# Altium project mimx8mn1dvtjzaa.PrjPcb
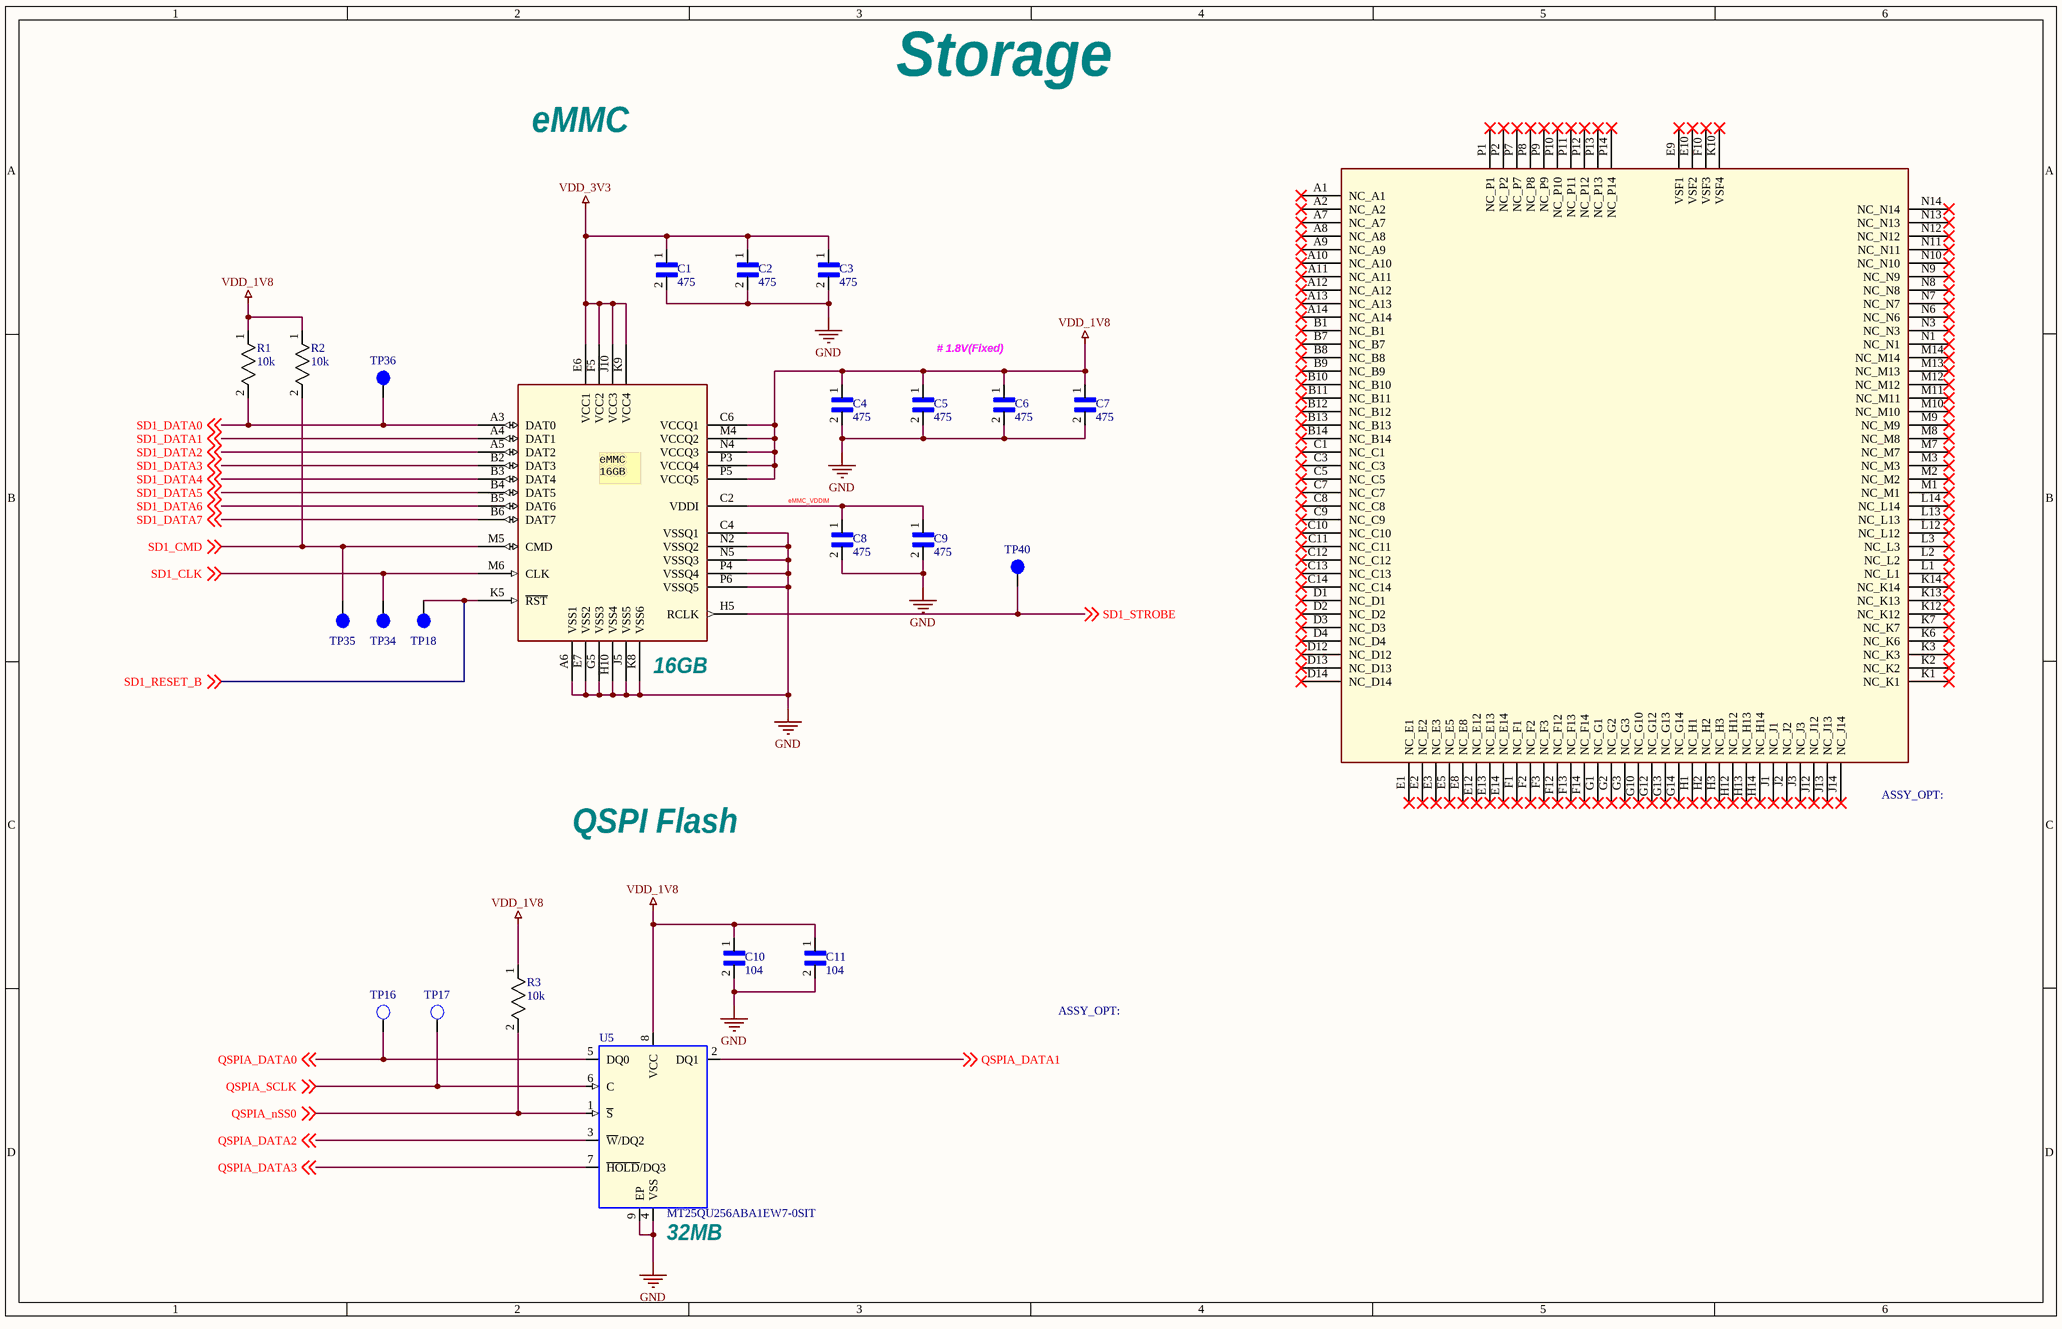
[diagram p0: eMMC_QSPI.SchDoc]
6 sheets, 53 parts. Net scope: global (net labels, ports and power ports of the same name join across sheets).
Board file: mimx8mn1dvtjzaa.PcbDoc
Sheets:
  block.SchDoc
  eMMC_QSPI.SchDoc
  LPDDR4.SchDoc
  mpu_power.SchDoc
  PMIC.SchDoc
  mpu_lpddr4.SchDoc

## Sheet block.SchDoc
size A; SheetNumber: 1; SheetTotal: 1

## Sheet eMMC_QSPI.SchDoc
size 386 x 246 mm; SheetNumber: 2; SheetTotal: 5

### Parts
C1  475  [CAPC1005X55N2]
C2  475  [CAPC1005X55N2]
C3  475  [CAPC1005X55N2]
C4  475  [CAPC1005X55N2]
C5  475  [CAPC1005X55N2]
C6  475  [CAPC1005X55N2]
C7  475  [CAPC1005X55N2]
C8  475  [CAPC1005X55N2]
C9  475  [CAPC1005X55N2]
C10  104  [CAPC1005X55N2]
C11  104  [CAPC1005X55N2]
R1  10k  [RC0402X]
R2  10k  [RC0402X]
R3  10k  [RC0402X]
TP16  TP_35MIL  [testpoint_35mil]  (value not drawn)
TP17  TP_35MIL  [testpoint_35mil]  (value not drawn)
TP18  tpad_020  [tpad_020]  (value not drawn)
TP34  tpad_020  [tpad_020]  (value not drawn)
TP35  TPAD_015  [TPAD_015]  (value not drawn)
TP36  tpad_020  [tpad_020]  (value not drawn)
TP40  TPAD_015  [TPAD_015]  (value not drawn)
U1  SDINBDG4-16G_VFBGA_153P  [BGA153N50P14X14_1300X1150X80]  (value not drawn)  (parts A,B of 2)
U5  MT25QU256ABA1EW7-0SIT  [dfn8_1p27_6x5mm_3p1]

### Nets
GND: C1.2 C2.2 C3.2 C4.2 C5.2 C6.2 C7.2 C8.2 C9.2 C10.2 C11.2 U1.A6(VSS1) U1.C4(VSSQ1) U1.E7(VSS2) U1.G5(VSS3) U1.H10(VSS4) U1.J5(VSS5) U1.K8(VSS6) U1.N2(VSSQ2) U1.N5(VSSQ3) U1.P4(VSSQ4) U1.P6(VSSQ5) U5.4(VSS) U5.9(EP)
VDD_1V8: C4.1 C5.1 C6.1 C7.1 C10.1 C11.1 R1.1 R2.1 R3.1 U1.C6(VCCQ1) U1.M4(VCCQ2) U1.N4(VCCQ3) U1.P3(VCCQ4) U1.P5(VCCQ5) U5.8(VCC)
VDD_3V3: C1.1 C2.1 C3.1 U1.E6(VCC1) U1.F5(VCC2) U1.J10(VCC3) U1.K9(VCC4)
eMMC_VDDIM: C8.1 C9.1 U1.C2(VDDI)
QSPIA_DATA0: TP16.1(TP) U5.5(DQ0) ; off-sheet QSPIA_DATA0
QSPIA_DATA1: U5.2(DQ1) ; off-sheet QSPIA_DATA1
QSPIA_DATA2: U5.3(~{W}/DQ2) ; off-sheet QSPIA_DATA2
QSPIA_DATA3: U5.7(~{HOLD}/DQ3) ; off-sheet QSPIA_DATA3
QSPIA_nSS0: R3.2 U5.1(~{S}) ; off-sheet QSPIA_nSS0
QSPIA_SCLK: TP17.1(TP) U5.6(C) ; off-sheet QSPIA_SCLK
SD1_CLK: TP34.1(Pin1) U1.M6(CLK) ; off-sheet SD1_CLK
SD1_CMD: R2.2 TP35.1(Pin1) U1.M5(CMD) ; off-sheet SD1_CMD
SD1_DATA0: R1.2 TP36.1(Pin1) U1.A3(DAT0) ; off-sheet SD1_DATA0
SD1_DATA1: U1.A4(DAT1) ; off-sheet SD1_DATA1
SD1_DATA2: U1.A5(DAT2) ; off-sheet SD1_DATA2
SD1_DATA3: U1.B2(DAT3) ; off-sheet SD1_DATA3
SD1_DATA4: U1.B3(DAT4) ; off-sheet SD1_DATA4
SD1_DATA5: U1.B4(DAT5) ; off-sheet SD1_DATA5
SD1_DATA6: U1.B5(DAT6) ; off-sheet SD1_DATA6
SD1_DATA7: U1.B6(DAT7) ; off-sheet SD1_DATA7
SD1_RESET_B: TP18.1(Pin1) U1.K5(~{RST}) ; off-sheet SD1_RESET_B
SD1_STROBE: TP40.1(Pin1) U1.H5(RCLK) ; off-sheet SD1_STROBE

Not connected (* = marked no-connect by the designer): U1 A1(NC_A1)* A2(NC_A2)* A7(NC_A7)* A8(NC_A8)* A9(NC_A9)* A10(NC_A10)* A11(NC_A11)* A12(NC_A12)* A13(NC_A13)* A14(NC_A14)* B1(NC_B1)* B7(NC_B7)* B8(NC_B8)* B9(NC_B9)* B10(NC_B10)* B11(NC_B11)* B12(NC_B12)* B13(NC_B13)* B14(NC_B14)* C1(NC_C1)* C3(NC_C3)* C5(NC_C5)* C7(NC_C7)* C8(NC_C8)* C9(NC_C9)* C10(NC_C10)* C11(NC_C11)* C12(NC_C12)* C13(NC_C13)* C14(NC_C14)* D1(NC_D1)* D2(NC_D2)* D3(NC_D3)* D4(NC_D4)* D12(NC_D12)* D13(NC_D13)* D14(NC_D14)* E1(NC_E1)* E2(NC_E2)* E3(NC_E3)* E5(NC_E5)* E8(NC_E8)* E9(VSF1)* E10(VSF2)* E12(NC_E12)* E13(NC_E13)* E14(NC_E14)* F1(NC_F1)* F2(NC_F2)* F3(NC_F3)* F10(VSF3)* F12(NC_F12)* F13(NC_F13)* F14(NC_F14)* G1(NC_G1)* G2(NC_G2)* G3(NC_G3)* G10(NC_G10)* G12(NC_G12)* G13(NC_G13)* G14(NC_G14)* H1(NC_H1)* H2(NC_H2)* H3(NC_H3)* H12(NC_H12)* H13(NC_H13)* H14(NC_H14)* J1(NC_J1)* J2(NC_J2)* J3(NC_J3)* J12(NC_J12)* J13(NC_J13)* J14(NC_J14)* K1(NC_K1)* K2(NC_K2)* K3(NC_K3)* K6(NC_K6)* K7(NC_K7)* K10(VSF4)* K12(NC_K12)* K13(NC_K13)* K14(NC_K14)* L1(NC_L1)* L2(NC_L2)* L3(NC_L3)* L12(NC_L12)* L13(NC_L13)* L14(NC_L14)* M1(NC_M1)* M2(NC_M2)* M3(NC_M3)* M7(NC_M7)* M8(NC_M8)* M9(NC_M9)* M10(NC_M10)* M11(NC_M11)* M12(NC_M12)* M13(NC_M13)* M14(NC_M14)* N1(NC_N1)* N3(NC_N3)* N6(NC_N6)* N7(NC_N7)* N8(NC_N8)* N9(NC_N9)* N10(NC_N10)* N11(NC_N11)* N12(NC_N12)* N13(NC_N13)* N14(NC_N14)* P1(NC_P1)* P2(NC_P2)* P7(NC_P7)* P8(NC_P8)* P9(NC_P9)* P10(NC_P10)* P11(NC_P11)* P12(NC_P12)* P13(NC_P13)* P14(NC_P14)*

### Notes on the sheet
- Storage
- eMMC
- # 1.8V(Fixed)
- (near U1) 16GB
- QSPI Flash
- (near U5) 32MB
- (in symbol SDINBDG4-16G_VFBGA_153P, part A) eMMC / 16GB

### Library data of the parts
C1-C9 = CC0402MRX5R6BB475: Multilayer Ceramic Capacitor, 4.7 uF, 50 V, ï¿½ 10%, X5R, 0402 [1005 Metric]; Manufacturer: Yageo; Capacitance: 4.7uF; Voltage Rating: 10V; Tolerance: 20%; Temperature Coefficient: 30ppm/°C; Supplier 1: Digikey; Manufacturer Part Number: CC0402MRX5R6BB475; RoHS: Yes; Category: Ceramic Capacitors; Stock 1: 1209136; Pricing 1: 1=0.1, 10=0.053, 50=0.0364, 100=0.0313, 500=0.0227, 1000=0.02003, 2500=0.01719, 5000=0.01547 (USD); Mount: Surface Mount; Case/Package: 0402; Case Code (Metric): 1005; Case Code (Imperial): 0402; Weight: 2.3E-05oz; Material: Ceramic; Min Operating Temperature: -55°C; Max Operating Temperature: 85°C; Packaging: Tape and Reel; Dielectric: X5R; Termination: SMD/SMT; Voltage Rating (DC): 10V; Package Quantity: 10000; Series: CC; Length: 0.039inch; Width: 0.02inch; Height: 0.5mm; Thickness: 0.022inch; Lead Free: Lead Free; Halogen Free: Halogen Free; RoHS Compliant: Yes; ComponentLink1URL: http://www.mouser.com/ds/2/447/Yageo_UPY-GP_NP0_16V-to-50V_9-358835.pdf?src-supplier=Mouser; ComponentLink1Description: http://www.mouser.com/ds/2/447/Yageo_UPY-GP_NP0_16V-to-50V_9-358835.pdf?src-supplier=Mouser; ComponentLink2URL: http://www.yageo.com/documents/recent/UPY-GPHC_X5R_4V-to-50V_25.pdf?src-supplier=Digikey; ComponentLink2Description: http://www.yageo.com/documents/recent/UPY-GPHC_X5R_4V-to-50V_25.pdf?src-supplier=Digikey; ComponentLink3URL: http://www.yageo.com/exep/pages/download/literatures/ProductSelectionGuide%202014_Final_2.pdf?src-supplier=Digikey; ComponentLink3Description: http://www.yageo.com/exep/pages/download/literatures/ProductSelectionGuide%202014_Final_2.pdf?src-supplier=Digikey; ComponentLink4URL: https://datasheet.octopart.com/CC0402MRX5R6BB475-Yageo-datasheet-140260304.pdf?src-supplier=Newark; ComponentLink4Description: https://datasheet.octopart.com/CC0402MRX5R6BB475-Yageo-datasheet-140260304.pdf?src-supplier=Newark; LCSC: C469468; Supplier Part Number 1: 311-1734-1-ND
C10 C11 = CC0402KRX7R7BB104: Multilayer Ceramic Capacitor, 0.1 uF, 16 V, ï¿½ 10%, X7R, 0402 [1005 Metric]; Manufacturer: Yageo; Material: 4241ConductorMaterial; Capacitance: 100nF; Voltage Rating: 16V; Temperature Coefficient: 30ppm/°C; Supplier 1: Digikey; Manufacturer Part Number: CC0402KRX7R7BB104; RoHS: Yes; Category: Ceramic Capacitors; Stock 1: 15609894; Pricing 1: 1=0.1, 10=0.024, 50=0.0164, 100=0.0139, 500=0.0098, 1000=0.00852, 2500=0.00718, 5000=0.00636 (USD); Mount: Surface Mount; Case/Package: 0402; Number of Pins: 2; Case Code (Metric): 1005; Case Code (Imperial): 0402; Min Operating Temperature: -55°C; Max Operating Temperature: 125°C; Tolerance: 10%; Voltage Rating (DC): 16V; Packaging: Tape and Reel; Package Quantity: 1; Dielectric: X7R; Termination: SMD/SMT; Voltage: 16V; Series: CC; Voltage Rating (AC): 16V; Length: 1mm; Width: 0.02inch; Height: 0.5mm; Thickness: 0.022inch; Depth: 0.5mm; Radiation Hardening: No; Reach SVHC Compliant: No; RoHS Compliant: Yes; Halogen Free: 5694HalogenFree; Lead Free: 5697LeadFree; ComponentLink1URL: https://datasheet.ciiva.com/11788/0900766b80ce67ed-11788364.pdf?src-supplier=Rs; ComponentLink1Description: https://datasheet.ciiva.com/11788/0900766b80ce67ed-11788364.pdf?src-supplier=Rs; ComponentLink2URL: https://datasheet.ciiva.com/7978/1489800-7978111.pdf?src-supplier=Element14; ComponentLink2Description: https://datasheet.ciiva.com/7978/1489800-7978111.pdf?src-supplier=Element14; ComponentLink3URL: https://datasheet.ciiva.com/161/mlccorderingcode-161545.pdf?src-supplier=Digikey; ComponentLink3Description: https://datasheet.ciiva.com/161/mlccorderingcode-161545.pdf?src-supplier=Digikey; ComponentLink4URL: https://datasheet.ciiva.com/161/mlccorderingcode-161544.pdf?src-supplier=Digikey; ComponentLink4Description: https://datasheet.ciiva.com/161/mlccorderingcode-161544.pdf?src-supplier=Digikey; ComponentLink5URL: https://datasheet.ciiva.com/161/mlccorderingcode-161546.pdf?src-supplier=Digikey; ComponentLink5Description: https://datasheet.ciiva.com/161/mlccorderingcode-161546.pdf?src-supplier=Digikey; ComponentLink6URL: https://datasheet.ciiva.com/8033/1734573-8033661.pdf?src-supplier=Element14; ComponentLink6Description: https://datasheet.ciiva.com/8033/1734573-8033661.pdf?src-supplier=Element14; ComponentLink7URL: https://datasheet.ciiva.com/11587/upy-gphc-x7r-6-3v-to-50v-8-11587305.pdf?src-supplier=Avnet; ComponentLink7Description: https://datasheet.ciiva.com/11587/upy-gphc-x7r-6-3v-to-50v-8-11587305.pdf?src-supplier=Avnet; LCSC: C60474; Supplier Part Number 1: 311-1338-1-ND
R1-R3 = RC0402JR-0710KL: SMD Chip Resistor, 10 kOhm, ï¿½ 5%, 62.5 mW, 0402 [1005 Metric], Thick Film, General Purpose; Manufacturer: Yageo; Resistance: 10kR; Power Rating: 62.5mW; Voltage Rating: 50V; Temperature Coefficient: 100ppm/°C; Max Power Dissipation: 63mW; Supplier 1: Digikey; Manufacturer Part Number: RC0402JR-0710KL; RoHS: Yes; Category: Chip SMD Resistors; Stock 1: 16677034; Pricing 1: 1=0.1, 10=0.007, 50=0.0066, 100=0.0061, 500=0.0051, 1000=0.00408, 5000=0.00284 (USD); Case/Package: 0402; Case Code (Metric): 1005; Case Code (Imperial): 0402; Size Code: 0402; Min Operating Temperature: -55°C; Max Operating Temperature: 155°C; Packaging: Tape and Reel; Tolerance: 5%; Package Quantity: 1; Resistor Type: Thick Film; Number of Terminations: 2; Termination: SMD/SMT; Features: Moisture Resistant; Series: RC; Resistance Tolerance: 5%; Construction: Rectangular; Voltage Rating (AC): 50V; Length: 0.039inch; Width: 0.02inch; Height: 0.016inch; Depth: 0.5mm; Military Standard: Not; Lead Free: Lead Free; RoHS Compliant: Yes; Reach SVHC Compliant: Unknown; ComponentLink1URL: https://datasheet.ciiva.com/2452/pyu-r-int-thick-7-2452626.pdf?src-supplier=Digikey; ComponentLink1Description: https://datasheet.ciiva.com/2452/pyu-r-int-thick-7-2452626.pdf?src-supplier=Digikey; ComponentLink2URL: https://datasheet.ciiva.com/2452/pyu-r-int-thick-7-2452627.pdf?src-supplier=Digikey; ComponentLink2Description: https://datasheet.ciiva.com/2452/pyu-r-int-thick-7-2452627.pdf?src-supplier=Digikey; ComponentLink3URL: https://datasheet.ciiva.com/2452/pyu-r-int-thick-7-2452628.pdf?src-supplier=Digikey; ComponentLink3Description: https://datasheet.ciiva.com/2452/pyu-r-int-thick-7-2452628.pdf?src-supplier=Digikey; ComponentLink4URL: https://datasheet.ciiva.com/7850/1018594-7850136.pdf?src-supplier=Element14; ComponentLink4Description: https://datasheet.ciiva.com/7850/1018594-7850136.pdf?src-supplier=Element14; ComponentLink5URL: https://datasheet.ciiva.com/7850/1018594-7850137.pdf?src-supplier=Element14; ComponentLink5Description: https://datasheet.ciiva.com/7850/1018594-7850137.pdf?src-supplier=Element14; ComponentLink6URL: https://datasheet.ciiva.com/12669/pyu-rc0402-51-rohs-l-6-r-12669687.pdf?src-supplier=Mouser; ComponentLink6Description: https://datasheet.ciiva.com/12669/pyu-rc0402-51-rohs-l-6-r-12669687.pdf?src-supplier=Mouser; Supplier Part Number 1: 311-10KJRCT-ND
TP16 TP17 = T POINT R: TEST POINT PAD .035 SMT, no part to order; ASSY_OPT: DNP; CLASS: IC; CAD_APPROVED: Yes; AGILE_PN: 510-75618; HEIGHT: 0.1MM; ROHS: Yes; PCB Footprint: testpoint_35mil
TP18 TP36 = TESTLOOP: TEST POINT PAD 0.5MM DIA SMT, NO PART TO ORDER; CLASS: IO; ASSY_OPT: DNP; AGILE_PN: 211-77484; CAD_APPROVED: Yes; ROHS: Yes; HEIGHT: 0.1MM; PCB Footprint: tpad_020
TP34 = TESTLOOP: TEST POINT PAD 0.5MM DIA SMT, NO PART TO ORDER; CLASS: IO; ASSY_OPT: DNP; CAD_APPROVED: Yes; AGILE_PN: 211-77484; HEIGHT: 0.1MM; ROHS: Yes; PCB Footprint: tpad_020
TP35 = TESTLOOP: TEST POINT PAD 15MIL DIA SMT, NO PART TO ORDER; CLASS: IO; ASSY_OPT: DNP; AGILE_PN: 211-76645; MFG_NAME01: NOTACOMPONENT; CAD_APPROVED: Yes; MFG_PN01: NOTACOMPONENT; ROHS: Yes; HEIGHT: 0.1MM; PCB Footprint: TPAD_015
TP40 = TESTLOOP: TEST POINT PAD 15MIL DIA SMT, NO PART TO ORDER; CLASS: IO; AGILE_PN: 211-76645; MFG_NAME01: NOTACOMPONENT; CAD_APPROVED: Yes; MFG_PN01: NOTACOMPONENT; ROHS: Yes; HEIGHT: 0.1MM; PCB Footprint: TPAD_015
U1 = SDINBDG4-16G_VFBGA_153P: CLASS: IC
U5 = MT25QL256ABA1EW9_9P: IC MEM FLASH SERIAL NOR 256MBIT 166MHZ 1.7-2V WPDFN8; AGILE_PN: 334-77688; MFG_NAME01: MICRON; CAD_APPROVED: Yes; CLASS: IC; PCB Footprint: dfn8_1p27_6x5mm_3p1; MFG_PN01: MT25QU256ABA1EW7-0SIT; ROHS: Yes; HEIGHT: 0.8 MM; VOLTAGE: 1.7-2V

## Sheet LPDDR4.SchDoc
size A3; SheetNumber: 3; SheetTotal: 3
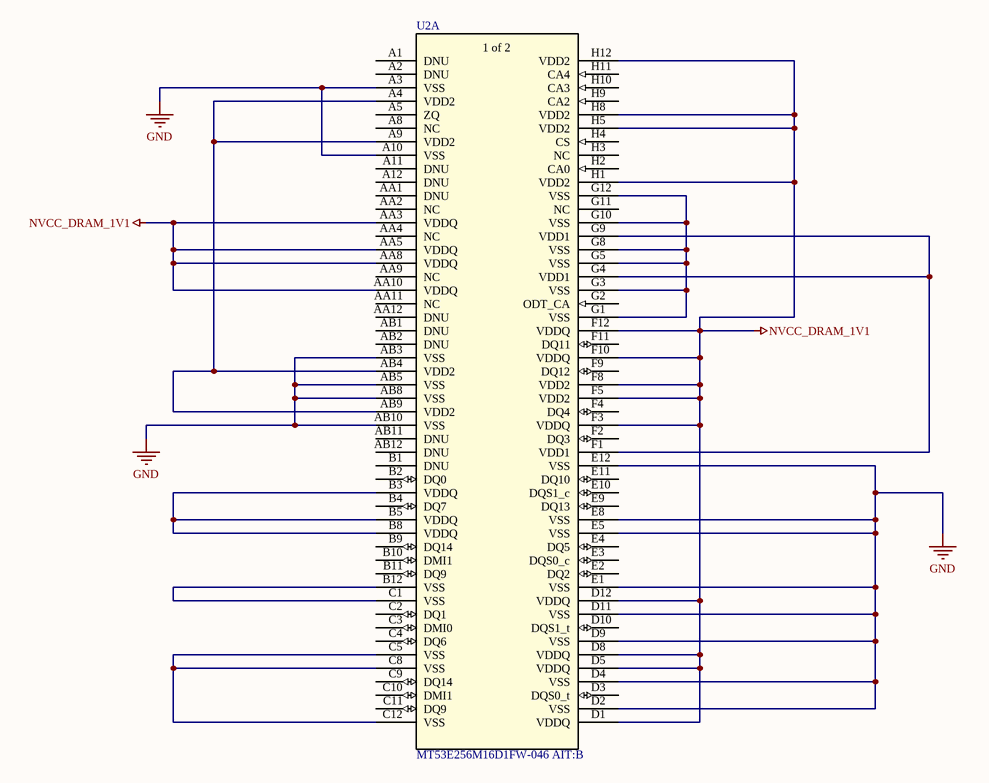
[diagram p1: LPDDR4.SchDoc]

### Parts
U2  MT53E256M16D1FW-046 AIT:B  [TFBGA200_10X14p5X1p1_FW_MRN-M]  (part A of 2)

### Nets
GND: U2.A3(VSS) U2.A10(VSS) U2.AB3(VSS) U2.AB5(VSS) U2.AB8(VSS) U2.AB10(VSS) U2.D2(VSS) U2.D4(VSS) U2.D9(VSS) U2.D11(VSS) U2.E1(VSS) U2.E5(VSS) U2.E8(VSS) U2.E12(VSS)
NVCC_DRAM_1V1: U2.AA3(VDDQ) U2.AA5(VDDQ) U2.AA8(VDDQ) U2.AA10(VDDQ) U2.D1(VDDQ) U2.D5(VDDQ) U2.D8(VDDQ) U2.D12(VDDQ) U2.F3(VDDQ) U2.F5(VDD2) U2.F8(VDD2) U2.F10(VDDQ) U2.F12(VDDQ) U2.H1(VDD2) U2.H5(VDD2) U2.H8(VDD2) U2.H12(VDD2)
NetU2_A4: U2.A4(VDD2) U2.A9(VDD2) U2.AB4(VDD2) U2.AB9(VDD2)
NetU2_B3: U2.B3(VDDQ) U2.B5(VDDQ) U2.B8(VDDQ)
NetU2_B12: U2.B12(VSS) U2.C1(VSS)
NetU2_C5: U2.C5(VSS) U2.C8(VSS) U2.C12(VSS)
NetU2_F1: U2.F1(VDD1) U2.G4(VDD1) U2.G9(VDD1)
NetU2_G1: U2.G1(VSS) U2.G3(VSS) U2.G5(VSS) U2.G8(VSS) U2.G10(VSS) U2.G12(VSS)

Not connected (* = marked no-connect by the designer): U2 A1(DNU) A2(DNU) A5(ZQ) A8(NC) A11(DNU) A12(DNU) AA1(DNU) AA2(NC) AA4(NC) AA9(NC) AA11(NC) AA12(DNU) AB1(DNU) AB2(DNU) AB11(DNU) AB12(DNU) B1(DNU) B2(DQ0) B4(DQ7) B9(DQ14) B10(DMI1) B11(DQ9) C2(DQ1) C3(DMI0) C4(DQ6) C9(DQ14) C10(DMI1) C11(DQ9) D3(DQS0_t) D10(DQS1_t) E2(DQ2) E3(DQS0_c) E4(DQ5) E9(DQ13) E10(DQS1_c) E11(DQ10) F2(DQ3) F4(DQ4) F9(DQ12) F11(DQ11) G2(ODT_CA) G11(NC) H2(CA0) H3(NC) H4(CS) H9(CA2) H10(CA3) H11(CA4)

### Notes on the sheet
- (in symbol MT53E256M16D1FW-046 AIT:B, part A) 1 of 2

### Library data of the parts
U2 = MT53E256M16D1FW-046 AIT:B: No Description Available; Mfr_Name: Micron; Type: Memory; RefDes: RefDes

## Sheet mpu_power.SchDoc
size A3; SheetNumber: 4; SheetTotal: 5
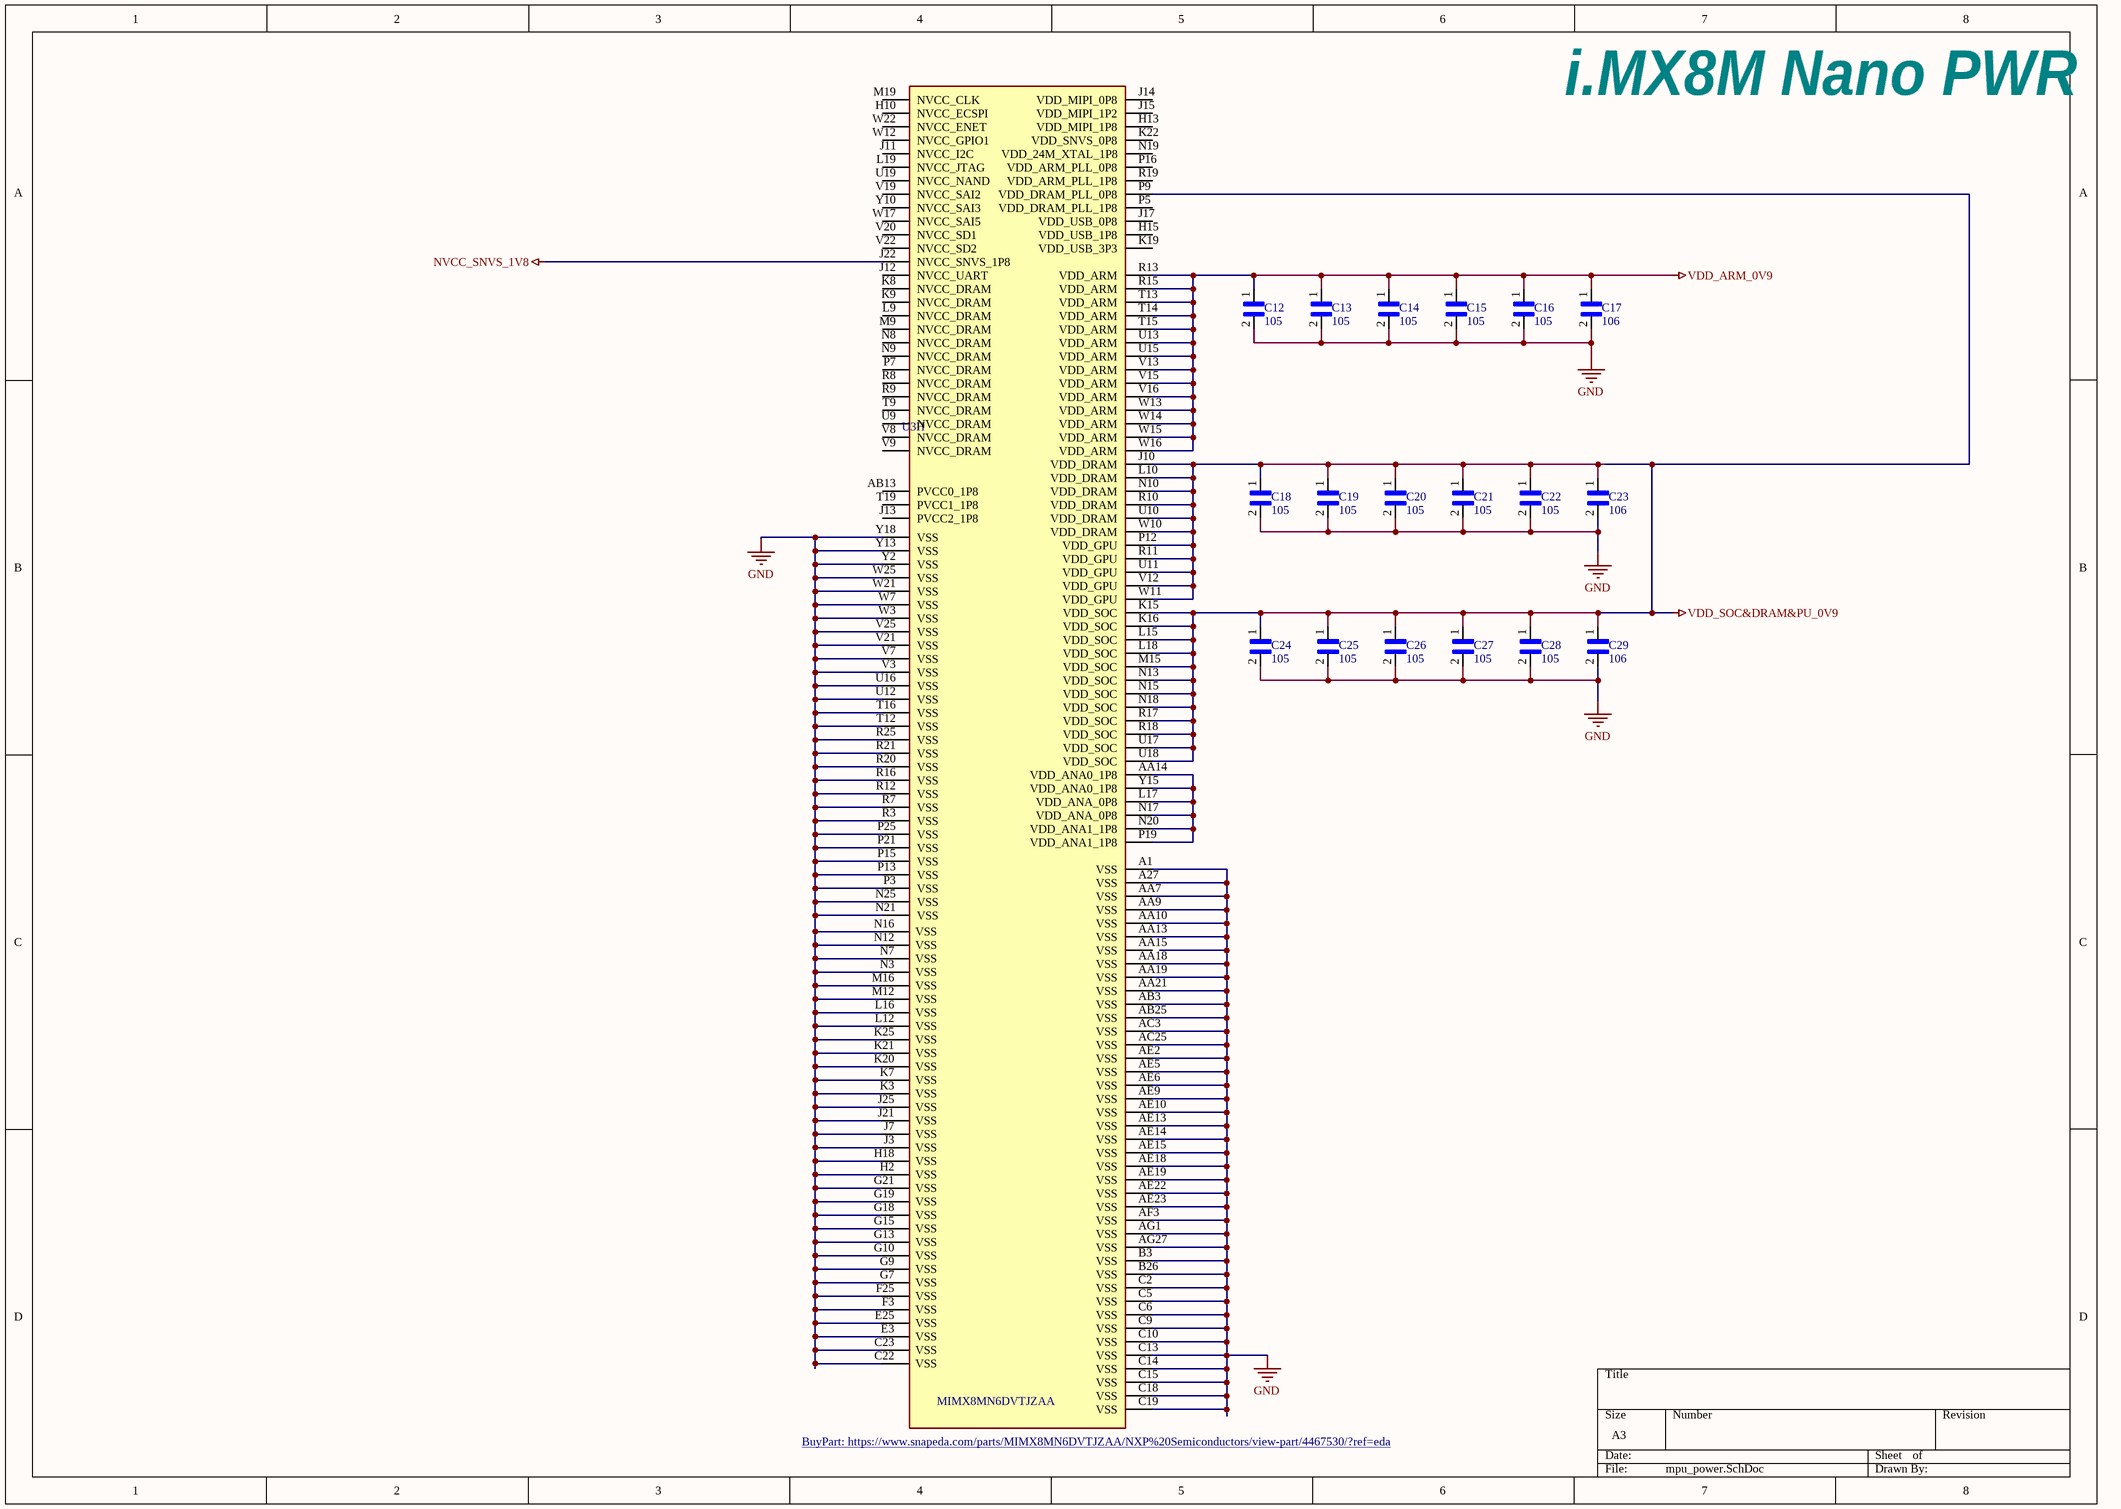
[diagram p2: mpu_power.SchDoc]

### Parts
C12  105  [RC0402]
C13  105  [RC0402]
C14  105  [RC0402]
C15  105  [RC0402]
C16  105  [RC0402]
C17  106  [CL05A106MQ5NUNC]
C18  105  [RC0402]
C19  105  [RC0402]
C20  105  [RC0402]
C21  105  [RC0402]
C22  105  [RC0402]
C23  106  [CL05A106MQ5NUNC]
C24  105  [RC0402]
C25  105  [RC0402]
C26  105  [RC0402]
C27  105  [RC0402]
C28  105  [RC0402]
C29  106  [CL05A106MQ5NUNC]
U3  MIMX8MN6DVTJZAA  [BGA486N50P27X27_1400X1400X125N]  (part H of 8)

### Nets
GND: C12.2 C13.2 C14.2 C15.2 C16.2 C17.2 C18.2 C19.2 C20.2 C21.2 C22.2 C23.2 C24.2 C25.2 C26.2 C27.2 C28.2 C29.2 U3.A1(VSS) U3.A27(VSS) U3.AA7(VSS) U3.AA9(VSS) U3.AA10(VSS) U3.AA13(VSS) U3.AA18(VSS) U3.AA19(VSS) U3.AA21(VSS) U3.AB3(VSS) U3.AB25(VSS) U3.AC3(VSS) U3.AC25(VSS) U3.AE2(VSS) U3.AE5(VSS) U3.AE6(VSS) U3.AE9(VSS) U3.AE10(VSS) U3.AE13(VSS) U3.AE14(VSS) U3.AE15(VSS) U3.AE18(VSS) U3.AE19(VSS) U3.AE22(VSS) U3.AE23(VSS) U3.AF3(VSS) U3.AG1(VSS) U3.AG27(VSS) U3.B3(VSS) U3.B26(VSS) U3.C2(VSS) U3.C5(VSS) U3.C6(VSS) U3.C9(VSS) U3.C10(VSS) U3.C13(VSS) U3.C14(VSS) U3.C15(VSS) U3.C18(VSS) U3.C19(VSS) U3.C22(VSS) U3.C23(VSS) U3.E3(VSS) U3.E25(VSS) U3.F3(VSS) U3.F25(VSS) U3.G7(VSS) U3.G9(VSS) U3.G10(VSS) U3.G13(VSS) U3.G15(VSS) U3.G18(VSS) U3.G19(VSS) U3.G21(VSS) U3.H2(VSS) U3.H18(VSS) U3.J3(VSS) U3.J7(VSS) U3.J21(VSS) U3.J25(VSS) U3.K3(VSS) U3.K7(VSS) U3.K20(VSS) U3.K21(VSS) U3.K25(VSS) U3.L12(VSS) U3.L16(VSS) U3.M12(VSS) U3.M16(VSS) U3.N3(VSS) U3.N7(VSS) U3.N12(VSS) U3.N16(VSS) U3.N21(VSS) U3.N25(VSS) U3.P3(VSS) U3.P13(VSS) U3.P15(VSS) U3.P21(VSS) U3.P25(VSS) U3.R3(VSS) U3.R7(VSS) U3.R12(VSS) U3.R16(VSS) U3.R20(VSS) U3.R21(VSS) U3.R25(VSS) U3.T12(VSS) U3.T16(VSS) U3.U12(VSS) U3.U16(VSS) U3.V3(VSS) U3.V7(VSS) U3.V21(VSS) U3.V25(VSS) U3.W3(VSS) U3.W7(VSS) U3.W21(VSS) U3.W25(VSS) U3.Y2(VSS) U3.Y13(VSS) U3.Y18(VSS)
NVCC_SNVS_1V8: U3.J22(NVCC_SNVS_1P8)
VDD_ARM_0V9: C12.1 C13.1 C14.1 C15.1 C16.1 C17.1 U3.R13(VDD_ARM) U3.R15(VDD_ARM) U3.T13(VDD_ARM) U3.T14(VDD_ARM) U3.T15(VDD_ARM) U3.U13(VDD_ARM) U3.U15(VDD_ARM) U3.V13(VDD_ARM) U3.V15(VDD_ARM) U3.V16(VDD_ARM) U3.W13(VDD_ARM) U3.W14(VDD_ARM) U3.W15(VDD_ARM) U3.W16(VDD_ARM)
VDD_SOC&DRAM&PU_0V9: C18.1 C19.1 C20.1 C21.1 C22.1 C23.1 C24.1 C25.1 C26.1 C27.1 C28.1 C29.1 U3.J10(VDD_DRAM) U3.K15(VDD_SOC) U3.K16(VDD_SOC) U3.L10(VDD_DRAM) U3.L15(VDD_SOC) U3.L18(VDD_SOC) U3.M15(VDD_SOC) U3.N10(VDD_DRAM) U3.N13(VDD_SOC) U3.N15(VDD_SOC) U3.N18(VDD_SOC) U3.P9(VDD_DRAM_PLL_0P8) U3.P12(VDD_GPU) U3.R10(VDD_DRAM) U3.R11(VDD_GPU) U3.R17(VDD_SOC) U3.R18(VDD_SOC) U3.U10(VDD_DRAM) U3.U11(VDD_GPU) U3.U17(VDD_SOC) U3.U18(VDD_SOC) U3.V12(VDD_GPU) U3.W10(VDD_DRAM) U3.W11(VDD_GPU)
NetU3_AA14: U3.AA14(VDD_ANA0_1P8) U3.L17(VDD_ANA_0P8) U3.N17(VDD_ANA_0P8) U3.N20(VDD_ANA1_1P8) U3.P19(VDD_ANA1_1P8) U3.Y15(VDD_ANA0_1P8)

Not connected (* = marked no-connect by the designer): U3 AA15(VSS) AB13(PVCC0_1P8) H10(NVCC_ECSPI) H13(VDD_MIPI_1P8) H15(VDD_USB_1P8) J11(NVCC_I2C) J12(NVCC_UART) J13(PVCC2_1P8) J14(VDD_MIPI_0P8) J15(VDD_MIPI_1P2) J17(VDD_USB_0P8) K8(NVCC_DRAM) K9(NVCC_DRAM) K19(VDD_USB_3P3) K22(VDD_SNVS_0P8) L9(NVCC_DRAM) L19(NVCC_JTAG) M9(NVCC_DRAM) M19(NVCC_CLK) N8(NVCC_DRAM) N9(NVCC_DRAM) N19(VDD_24M_XTAL_1P8) P5(VDD_DRAM_PLL_1P8) P7(NVCC_DRAM) P16(VDD_ARM_PLL_0P8) R8(NVCC_DRAM) R9(NVCC_DRAM) R19(VDD_ARM_PLL_1P8) T9(NVCC_DRAM) T19(PVCC1_1P8) U9(NVCC_DRAM) U19(NVCC_NAND) V8(NVCC_DRAM) V9(NVCC_DRAM) V19(NVCC_SAI2) V20(NVCC_SD1) V22(NVCC_SD2) W12(NVCC_GPIO1) W17(NVCC_SAI5) W22(NVCC_ENET) Y10(NVCC_SAI3)

### Notes on the sheet
- i.MX8M Nano PWR

### Library data of the parts
C12-C16 C18-C22 C24-C28 = CC0402KRX5R5BB105: Multilayer Ceramic Capacitor, 1 uF, 100 V, ï¿½ 10%, X7R, 0402 [1005 Metric]; Manufacturer: Yageo; Capacitance: 1uF; Voltage Rating: 6.3V; Dielectric: X5R; Temperature Coefficient: 30ppm/°C; Supplier 1: Digikey; Manufacturer Part Number: CC0402KRX5R5BB105; RoHS: Yes; Category: Ceramic Capacitors; Stock 1: 21136934; Pricing 1: 1=0.1, 10=0.054, 100=0.0318, 1000=0.02066, 2500=0.01646, 5000=0.01625 (USD); Mount: Surface Mount; Case/Package: 0402; Number of Pins: 2; Case Code (Metric): 1005; Case Code (Imperial): 0402; Dielectric Material: Ceramic; Material: Ceramic; Min Operating Temperature: -55°C; Max Operating Temperature: 85°C; Tolerance: 10%; Voltage Rating (DC): 6.3V; Packaging: Tape and Reel; Termination: SMD/SMT; Series: CC; Voltage Rating (AC): 6.3V; Length: 1mm; Width: 0.5mm; Height: 0.5mm; Depth: 0.5mm; Radiation Hardening: No; Reach SVHC Compliant: No; Lead Free: Lead Free; RoHS Compliant: Yes; Halogen Free: 5694HalogenFree; ComponentLink1URL: https://datasheet.ciiva.com/5789/70765-5789520.pdf?src-supplier=Farnell; ComponentLink1Description: https://datasheet.ciiva.com/5789/70765-5789520.pdf?src-supplier=Farnell; ComponentLink2URL: https://datasheet.ciiva.com/176/mlccorderingcode-176609.pdf?src-supplier=Digikey; ComponentLink2Description: https://datasheet.ciiva.com/176/mlccorderingcode-176609.pdf?src-supplier=Digikey; ComponentLink3URL: https://datasheet.ciiva.com/176/mlccorderingcode-176610.pdf?src-supplier=Digikey; ComponentLink3Description: https://datasheet.ciiva.com/176/mlccorderingcode-176610.pdf?src-supplier=Digikey; ComponentLink4URL: https://datasheet.ciiva.com/176/mlccorderingcode-176611.pdf?src-supplier=Digikey; ComponentLink4Description: https://datasheet.ciiva.com/176/mlccorderingcode-176611.pdf?src-supplier=Digikey; ComponentLink5URL: https://datasheet.ciiva.com/11464/upy-gphc-x5r-4v-to-50v-12-11464863.pdf?src-supplier=Avnet; ComponentLink5Description: https://datasheet.ciiva.com/11464/upy-gphc-x5r-4v-to-50v-12-11464863.pdf?src-supplier=Avnet; ComponentLink6URL: https://datasheet.ciiva.com/8033/1525783-8033643.pdf?src-supplier=Element14; ComponentLink6Description: https://datasheet.ciiva.com/8033/1525783-8033643.pdf?src-supplier=Element14; ComponentLink7URL: https://datasheet.ciiva.com/8033/1525783-8033644.pdf?src-supplier=Element14; ComponentLink7Description: https://datasheet.ciiva.com/8033/1525783-8033644.pdf?src-supplier=Element14; ComponentLink8URL: https://datasheet.ciiva.com/8033/70765-8033646.pdf?src-supplier=Element14; ComponentLink8Description: https://datasheet.ciiva.com/8033/70765-8033646.pdf?src-supplier=Element14; ComponentLink9URL: https://datasheet.ciiva.com/28450/1359354-28450285.pdf?src-supplier=Element14; ComponentLink9Description: https://datasheet.ciiva.com/28450/1359354-28450285.pdf?src-supplier=Element14; Supplier Part Number 1: 311-1438-1-ND
C17 C23 C29 = CL05A106MQ5NUNC: Multilayer Ceramic Capacitor, 10 uF, 6.3 V, ï¿½ 20%, X5R, 0402 [1005 Metric]; Manufacturer: Samsung; Capacitance: 10uF; Voltage Rating: 6.3V; Supplier 1: Avnet; Manufacturer Part Number: CL05A106MQ5NUNC; RoHS: Yes; Category: Ceramic Capacitors; Stock 1: 540000; Pricing 1: 10000=0.02499, 20000=0.02486, 40000=0.02474, 60000=0.02461, 80000=0.02448 (USD); Mount: Surface Mount; Case/Package: 0402; Case Code (Metric): 1005; Case Code (Imperial): 0402; Min Operating Temperature: -55°C; Max Operating Temperature: 85°C; Packaging: Tape and Reel; Tolerance: 20%; Package Quantity: 1; Dielectric: X5R; Series: CL; Construction: Flat; Length: 1mm; Width: 0.02inch; Height: 0.5mm; Thickness: 0.028inch; Depth: 0.5mm; Radiation Hardening: No; RoHS Compliant: Yes; ComponentLink1URL: https://datasheet.ciiva.com/16437/cl05a106mq5nunc-16437356.pdf?src-supplier=Future+Electronics; ComponentLink1Description: https://datasheet.ciiva.com/16437/cl05a106mq5nunc-16437356.pdf?src-supplier=Future+Electronics; ComponentLink2URL: https://datasheet.ciiva.com/26877/getdatasheetpartid-355289-26877841.pdf?src-supplier=Verical; ComponentLink2Description: https://datasheet.ciiva.com/26877/getdatasheetpartid-355289-26877841.pdf?src-supplier=Verical; Supplier Part Number 1: CL05A106MQ5NUNC
U3 = MIMX8MN6DVTJZAA: ARMÂ® CortexÂ®-A53 Microprocessor IC i.MX8MN 4 Core, 32-Bit 1.5GHz 486-LFBGA (14x14); MF: NXP USA Inc.; Package: LFBGA-486 NXP USA Inc.; Price: None; Mouser-Purchase-URL: https://snapeda.com/shop?store=Mouser&id=4467530; Availability: Warning; MP: MIMX8MN6DVTJZAA; SnapEDA_Link: https://www.snapeda.com/parts/MIMX8MN6DVTJZAA/NXP%20Semiconductors/view-part/4467530/?ref=snap; Value: *; Arrow_Electronics-Purchase-URL: https://snapeda.com/shop?store=Arrow+Electronics&id=4467530; BuyPart: https://www.snapeda.com/parts/MIMX8MN6DVTJZAA/NXP%20Semiconductors/view-part/4467530/?ref=eda

## Sheet PMIC.SchDoc
size A3; SheetNumber: 5; SheetTotal: 6
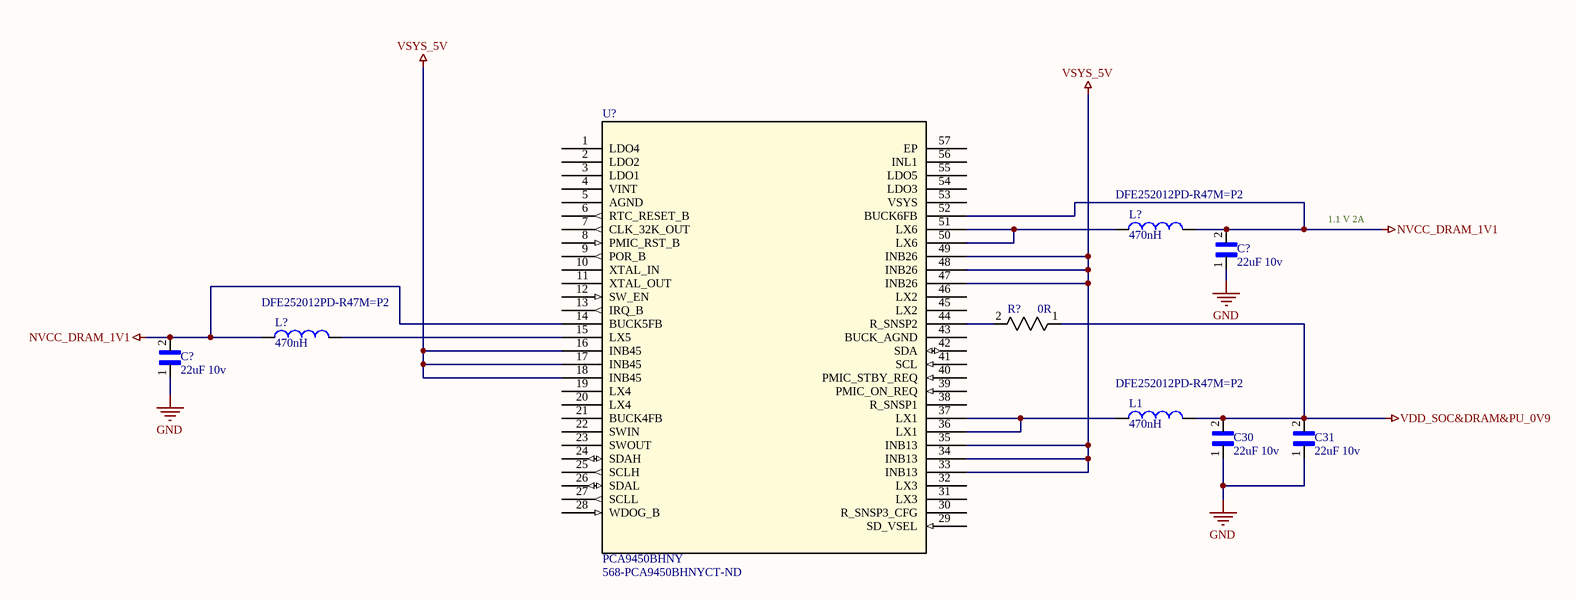
[diagram p3: PMIC.SchDoc]

### Parts
(Parts that share a designator on the sheet are numbered #1, #2 ... from top to bottom, then left to right.)
*  PCA9450BHNY  Supplier Part Number 1: 568-PCA9450BHNYCT-ND  [HVQFN56_SOT949-6_NXP]
C30  22uF 10v  [CAPC1608X100N]
C31  22uF 10v  [CAPC1608X100N]
C?#1  22uF 10v  [CAPC1608X100N]
C?#2  22uF 10v  [CAPC1608X100N]
L1  DFE252012PD-R47M=P2  Inductance: 470nH  [IND-SMD_L2.5-W2.0_SWPA252012S]
L?#1  DFE252012PD-R47M=P2  Inductance: 470nH  [IND-SMD_L2.5-W2.0_SWPA252012S]
L?#2  DFE252012PD-R47M=P2  Inductance: 470nH  [IND-SMD_L2.5-W2.0_SWPA252012S]
R?  0R  [RC0402X]

### Nets
GND: C30.1 C31.1 C?#1.1 C?#2.1
NVCC_DRAM_1V1: *.14(BUCK5FB) *.52(BUCK6FB) C?#1.2 C?#2.2 L?#1.2 L?#2.1
VDD_SOC&DRAM&PU_0V9: C30.2 C31.2 L1.2 R?.1
VSYS_5V: *.16(INB45) *.17(INB45) *.18(INB45) *.33(INB13) *.34(INB13) *.35(INB13) *.47(INB26) *.48(INB26) *.49(INB26)
Net*_15: *.15(LX5) L?#2.2
Net*_36: *.36(LX1) *.37(LX1) L1.1
Net*_44: *.44(R_SNSP2) R?.2
Net*_50: *.50(LX6) *.51(LX6) L?#1.1

Not connected (* = marked no-connect by the designer): * 1(LDO4) 2(LDO2) 3(LDO1) 4(VINT) 5(AGND) 6(RTC_RESET_B) 7(CLK_32K_OUT) 8(PMIC_RST_B) 9(POR_B) 10(XTAL_IN) 11(XTAL_OUT) 12(SW_EN) 13(IRQ_B) 19(LX4) 20(LX4) 21(BUCK4FB) 22(SWIN) 23(SWOUT) 24(SDAH) 25(SCLH) 26(SDAL) 27(SCLL) 28(WDOG_B) 29(SD_VSEL) 30(R_SNSP3_CFG) 31(LX3) 32(LX3) 38(R_SNSP1) 39(PMIC_ON_REQ) 40(PMIC_STBY_REQ) 41(SCL) 42(SDA) 43(BUCK_AGND) 45(LX2) 46(LX2) 53(VSYS) 54(LDO3) 55(LDO5) 56(INL1) 57(EP)

### Notes on the sheet
- 1.1 V 2A

### Library data of the parts
* = PCA9450BHNY: Power Manage Ic (Pmic) For I.mx 8M Nano Rohs Compliant: Yes |Nxp PCA9450BHNY; Manufacturer: NXP Semiconductors
C30 C31 C?#1 C?#2 = GRM188R61A226ME15D: SMD Capacitor X5R(EIA) with Capacitance: 22uF Tol. 20%. Rated Voltage: 10Vdc; Value: *; Availability: Unavailable; Package: None; MP: GRM188R61A226ME15D; Price: None
L1 L?#1 L?#2 = DFE252012PD-R47M=P2: Inductor Power Shielded Wirewound 0.47uH 20% 1MHz Metal 4A 0.027Ohm DCR 1008 Automotive T/R; Manufacturer: Murata; Saturation Current: 5.2A; Series Resistance: 27mR; Supplier 1: Digikey; RoHS: Yes; Category: Fixed Inductors; Stock 1: 54000; Pricing 1: 3000=0.20501, 6000=0.19333, 9000=0.18681, 15000=0.17892, 21000=0.17392, 30000=0.16876 (USD); Min Operating Temperature: -40°C; Max Operating Temperature: 125°C; Inductance Tolerance: 20%; RMS Current (Irms): 4A; Test Frequency: 1MHz; Tolerance: 20%; RoHS Compliant: Yes; ComponentLink1URL: http://www.farnell.com/datasheets/2616814.pdf?src-supplier=Farnell; ComponentLink1Description: http://www.farnell.com/datasheets/2616814.pdf?src-supplier=Farnell; ComponentLink2URL: https://search.murata.co.jp/Ceramy/image/img/P02/J(E)TE243A-9102.pdf?src-supplier=Digikey; ComponentLink2Description: https://search.murata.co.jp/Ceramy/image/img/P02/J(E)TE243A-9102.pdf?src-supplier=Digikey; ComponentLink3URL: http://www.farnell.com/datasheets/2616814.pdf?src-supplier=Newark; ComponentLink3Description: http://www.farnell.com/datasheets/2616814.pdf?src-supplier=Newark; Supplier Part Number 1: 490-DFE252012PD-R47M=P2TR-ND; Current Rating: 4A; Manufacturer Part Number: DFE252012PD-R47M=P2; Height: 1.2mm
R? = CR0402AJ/-000GAS: Zero Ohm Resistor, Jumper, 0402 [1005 Metric], Thick Film, 63 mW, 1 A, Surface Mount; Manufacturer: Bourns; Max Power Dissipation: 63mW; Temperature Coefficient: 500ppm/°C; Voltage Rating (DC): 50V; Supplier 1: Digikey; Manufacturer Part Number: CR0402AJ/-000GAS; RoHS: Yes; Category: Chip SMD Resistors; Stock 1: 124642; Pricing 1: 1=0.1, 10=0.024, 50=0.0144, 100=0.0117, 500=0.00752, 1000=0.00635, 5000=0.00451 (USD); Case/Package: 0402; Case Code (Imperial): 0402; Case Code (Metric): 1005; Min Operating Temperature: -55°C; Max Operating Temperature: 155°C; Features: Moisture Resistant,Automotive AEC-Q200,Anti-Sulfur; Series: CR0402A-AS; Packaging: Cut Tape; Resistance: 0R; Number of Terminations: 2; Power Rating: 63mW; Ratings: AEC-Q200; ComponentLink1URL: https://www.bourns.com/docs/product-datasheets/crxxxxa-as.pdf?src-supplier=Digikey; ComponentLink1Description: https://www.bourns.com/docs/product-datasheets/crxxxxa-as.pdf?src-supplier=Digikey; Supplier Part Number 1: CR0402AJ/-000GASCT-ND

## Sheet mpu_lpddr4.SchDoc
size A; SheetNumber: 6; SheetTotal: 6
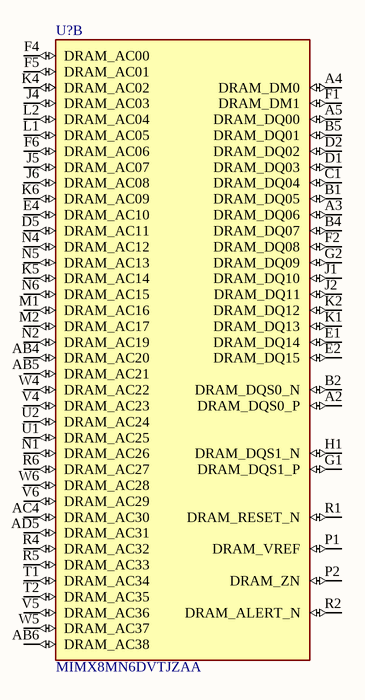
[diagram p4: mpu_lpddr4.SchDoc]

### Parts
U?  MIMX8MN6DVTJZAA  [BGA486N50P27X27_1400X1400X125N]  (part B of 8)

### Nets

Not connected (* = marked no-connect by the designer): U? A2(DRAM_DQS0_P) A3(DRAM_DQ06) A4(DRAM_DM0) A5(DRAM_DQ00) AB4(DRAM_AC20) AB5(DRAM_AC21) AB6(DRAM_AC38) AC4(DRAM_AC30) AD5(DRAM_AC31) B1(DRAM_DQ05) B2(DRAM_DQS0_N) B4(DRAM_DQ07) B5(DRAM_DQ01) C1(DRAM_DQ04) D1(DRAM_DQ03) D2(DRAM_DQ02) D5(DRAM_AC11) E1(DRAM_DQ14) E2(DRAM_DQ15) E4(DRAM_AC10) F1(DRAM_DM1) F2(DRAM_DQ08) F4(DRAM_AC00) F5(DRAM_AC01) F6(DRAM_AC06) G1(DRAM_DQS1_P) G2(DRAM_DQ09) H1(DRAM_DQS1_N) J1(DRAM_DQ10) J2(DRAM_DQ11) J4(DRAM_AC03) J5(DRAM_AC07) J6(DRAM_AC08) K1(DRAM_DQ13) K2(DRAM_DQ12) K4(DRAM_AC02) K5(DRAM_AC14) K6(DRAM_AC09) L1(DRAM_AC05) L2(DRAM_AC04) M1(DRAM_AC16) M2(DRAM_AC17) N1(DRAM_AC26) N2(DRAM_AC19) N4(DRAM_AC12) N5(DRAM_AC13) N6(DRAM_AC15) P1(DRAM_VREF) P2(DRAM_ZN) R1(DRAM_RESET_N) R2(DRAM_ALERT_N) R4(DRAM_AC32) R5(DRAM_AC33) R6(DRAM_AC27) T1(DRAM_AC34) T2(DRAM_AC35) U1(DRAM_AC25) U2(DRAM_AC24) V4(DRAM_AC23) V5(DRAM_AC36) V6(DRAM_AC29) W4(DRAM_AC22) W5(DRAM_AC37) W6(DRAM_AC28)

### Library data of the parts
U? = MIMX8MN6DVTJZAA: as U3 on sheet mpu_power; Package: LFBGA-486 NXP USA Inc.; Price: None; Mouser-Purchase-URL: https://snapeda.com/shop?store=Mouser&id=4467530; Availability: Warning; MP: MIMX8MN6DVTJZAA; SnapEDA_Link: https://www.snapeda.com/parts/MIMX8MN6DVTJZAA/NXP%20Semiconductors/view-part/4467530/?ref=snap; Value: *; Arrow_Electronics-Purchase-URL: https://snapeda.com/shop?store=Arrow+Electronics&id=4467530; BuyPart: https://www.snapeda.com/parts/MIMX8MN6DVTJZAA/NXP%20Semiconductors/view-part/4467530/?ref=eda

## Nets that join several sheets
GND: eMMC_QSPI (24 pins), LPDDR4 (14 pins), mpu_power (120 pins), PMIC (C30.1 C31.1 C?#1.1 C?#2.1)
NVCC_DRAM_1V1: LPDDR4 (17 pins), PMIC (6 pins)
VDD_SOC&DRAM&PU_0V9: mpu_power (36 pins), PMIC (C30.2 C31.2 L1.2 R?.1)